# Altium schematic sheet power.SchDoc
size A2; SPICEModelCacheUWPXBFBI: <root> / <DocumentId>UWPXBFBI</DocumentId> / </root>
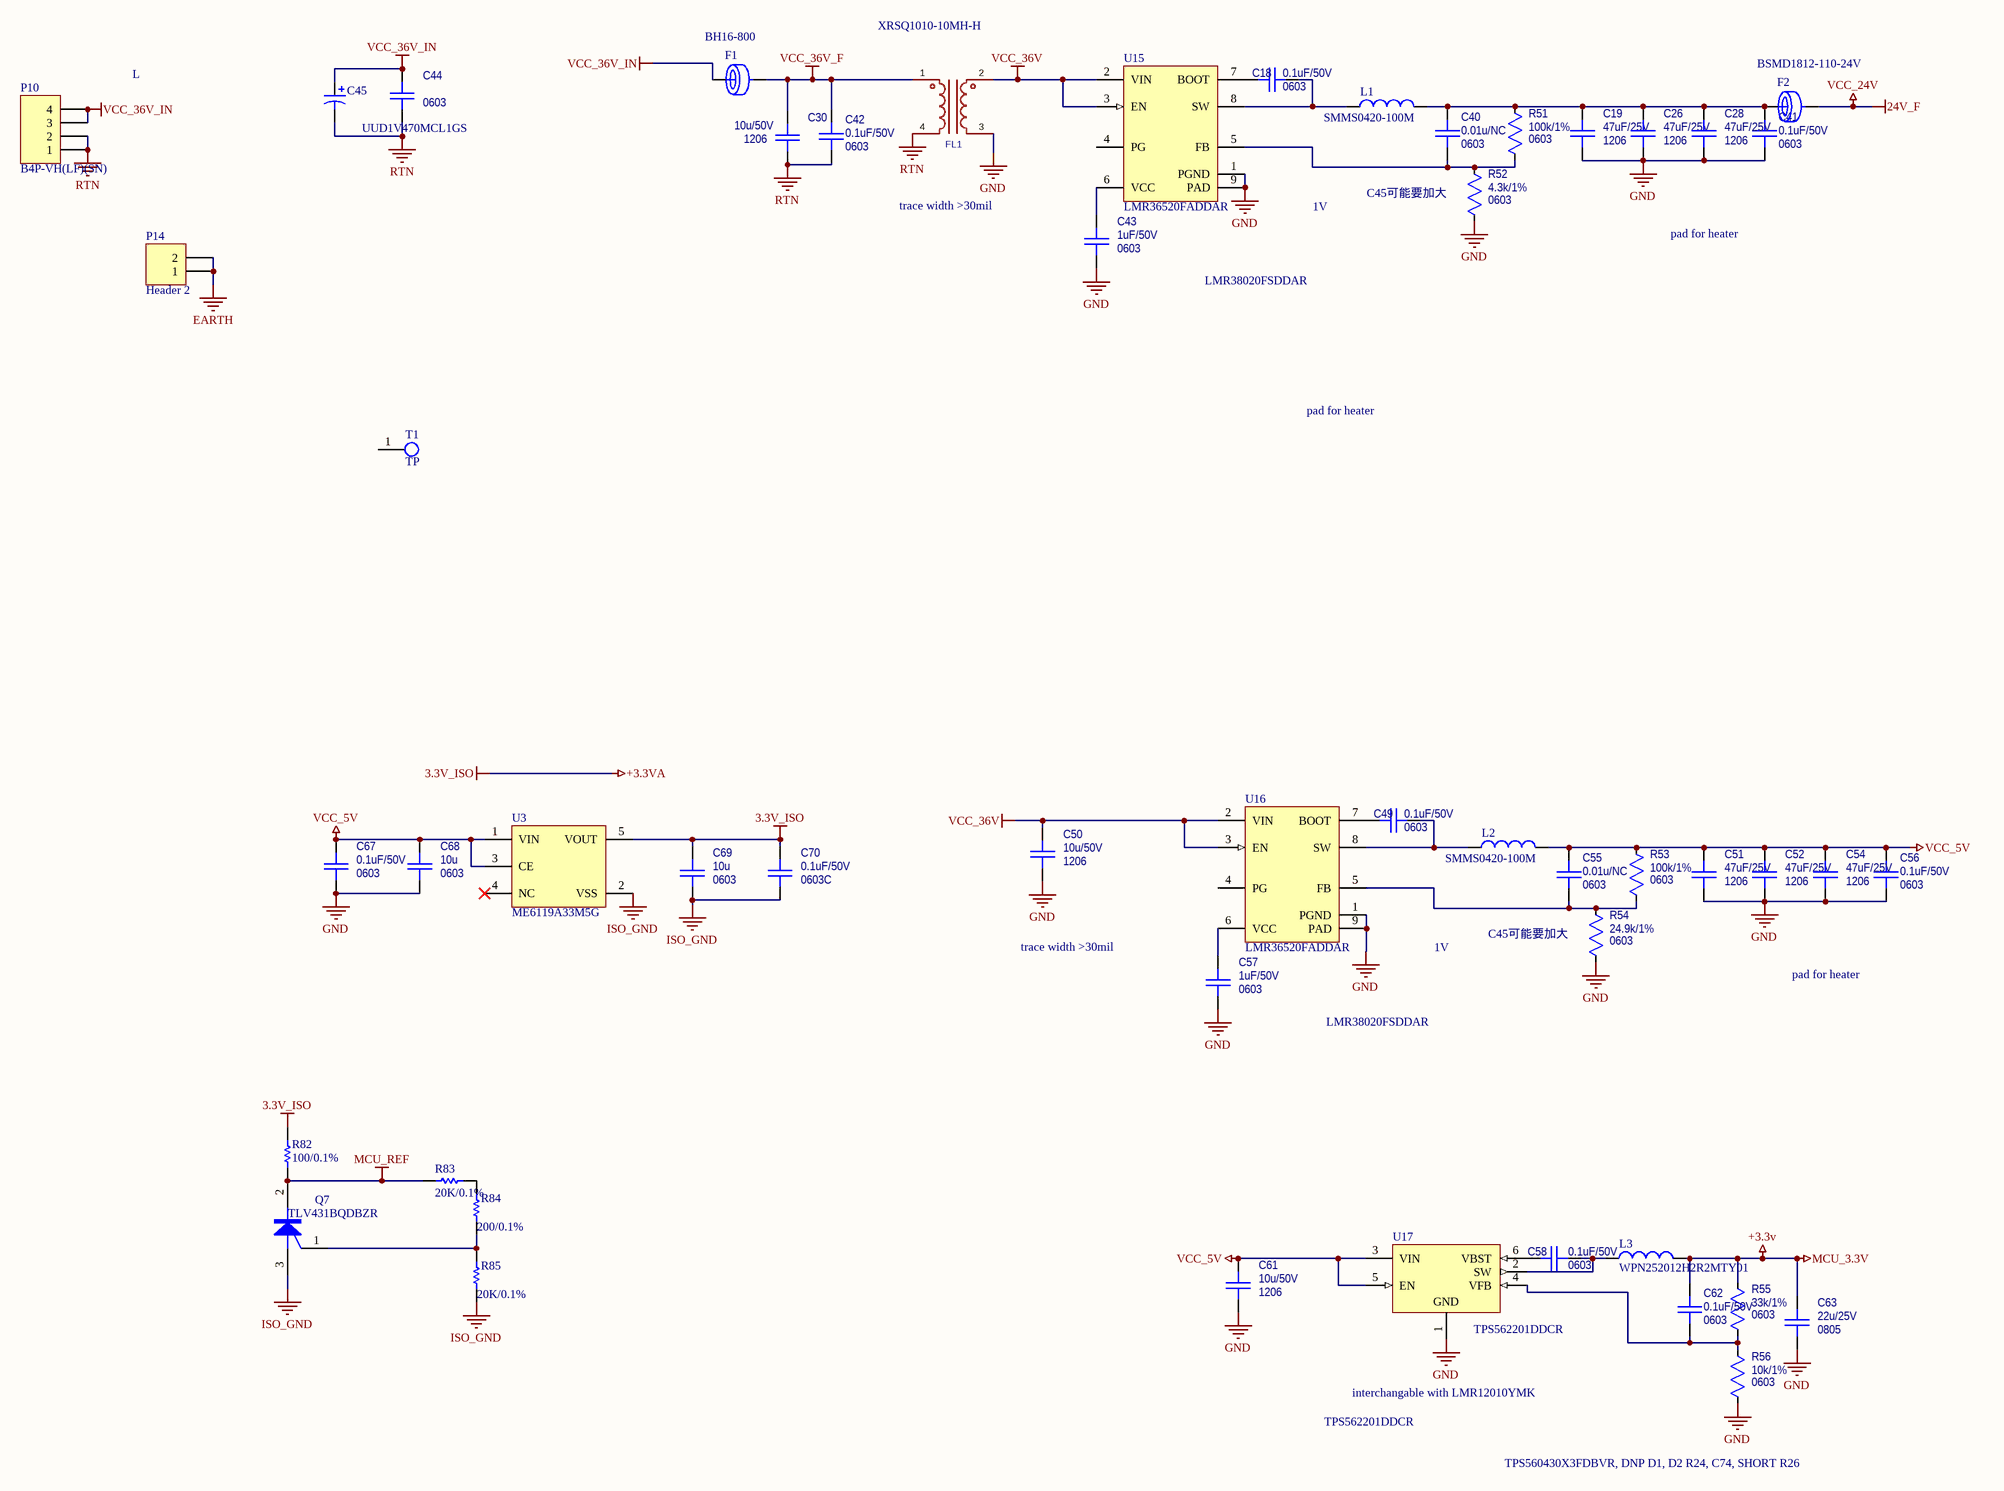
[diagram p0: power.SchDoc]

## Parts
C18  Package: 0603  [0603C]  (hidden comment: 0.1uF/50V)
C19  Package: 1206  [CAPC3216X156N_1206]  (hidden comment: 47uF/25V)
C26  Package: 1206  [CAPC3216X156N_1206]  (hidden comment: 47uF/25V)
C28  Package: 1206  [CAPC3216X156N_1206]  (hidden comment: 47uF/25V)
C30  Package: 1206  [CAPC3216X156N_1206]  (hidden comment: 10u/50V)
C40  value 0.01u/NC  Package: 0603  [0603C]  (hidden comment: 0.01uF/50V)  (no BOM)
C41  Package: 0603  [0603C]  (hidden comment: 0.1uF/50V)
C42  Package: 0603  [0603C]  (hidden comment: 0.1uF/50V)
C43  Package: 0603  [0603C]  (hidden comment: 1uF/50V)
C44  Package: 0603  [0603c]  (hidden comment: 10uF/16V)
C45  UUD1V470MCL1GS  [Φ10×10]
C49  Package: 0603  [0603C]  (hidden comment: 0.1uF/50V)
C50  Package: 1206  [CAPC3216X156N_1206]  (hidden comment: 10u/50V)
C51  Package: 1206  [CAPC3216X156N_1206]  (hidden comment: 47uF/25V)
C52  Package: 1206  [CAPC3216X156N_1206]  (hidden comment: 47uF/25V)
C54  Package: 1206  [CAPC3216X156N_1206]  (hidden comment: 47uF/25V)
C55  value 0.01u/NC  Package: 0603  [0603C]  (hidden comment: 0.01uF/50V)  (no BOM)
C56  Package: 0603  [0603C]  (hidden comment: 0.1uF/50V)
C57  Package: 0603  [0603C]  (hidden comment: 1uF/50V)
C58  Package: 0603  [0603C]  (hidden comment: 0.1uF/50V)
C61  Package: 1206  [CAPC3216X156N_1206]  (hidden comment: 10u/50V)
C62  Package: 0603  [0603C]  (hidden comment: 0.1uF/50V)  (no BOM)
C63  Package: 0805  [CAPC2012X127N_0805]  (hidden comment: 22u/25V)
C67  Package: 0603  [0603C]  (hidden comment: 0.1uF/50V)
C68  value 10u  Package: 0603  [0603c]  (hidden comment: 10uF/16V)
C69  value 10u  Package: 0603  [0603c]  (hidden comment: 10uF/16V)
C70  0.1uF/50V  [0603C]
F1  BH16-800  [FUSE-TH_L14.0-W3.0-P5.10-D0.8-LS1.20]
F2  BSMD1812-110-24V  [1812-F]
FL1  XRSQ1010-10MH-H  [IND-TH_4P-L14.0-W12.0_XRSQ1010-10MH-H]
L1  SMMS0420-100M  [IND-SMD_L4.5-W4.5_SMMS0420]
L2  SMMS0420-100M  [IND-SMD_L4.5-W4.5_SMMS0420]
L3  WPN252012H2R2MTY01  [PULS-BDCD00252012_V]
P10  B4P-VH(LF)(SN)  [CONN-TH_4P-P3.96_HX-VH3.96-4P-ZZ]
P14  Header 2  [插片端子4.8*0.8mm]
Q7  TLV431BQDBZR  [SOT23-3]
R51  Package: 0603  [0603R]  (hidden comment: 100k/1%)
R52  Package: 0603  [0603R]  (hidden comment: 4.3k/1%)
R53  Package: 0603  [0603R]  (hidden comment: 100k/1%)
R54  Package: 0603  [0603R]  (hidden comment: 24.9k/1%)
R55  Package: 0603  [0603R]  (hidden comment: 33k/1%)
R56  Package: 0603  [0603R]  (hidden comment: 10k/1%)
R82  100/0.1%  [0603R]
R83  20K/0.1%  [0603R]
R84  200/0.1%  [0603R]
R85  20K/0.1%  [0603R]
T1  TP  [SQP-1181C]
U3  ME6119A33M5G  [MCRN-SOT23-5_V]
U15  LMR36520FADDAR  [DDA0008A_M]
U16  LMR36520FADDAR  [DDA0008A_M]
U17  TPS562201DDCR  [DDC0006A_L]

## Nets
24V_F: F2.2  [also labelled VCC_24V]
+3.3v: C62.1 C63.1 L3.2 R55.2  [also labelled MCU_3.3V]
+3.3VA: C69.1 C70.1 R82.1 U3.5(VOUT)  [also labelled 3.3V_ISO]
EARTH: P14.1 P14.2
GND: C19.2 C26.2 C28.2 C41.2 C43.2 C50.2 C51.2 C52.2 C54.2 C56.2 C57.2 C61.2 C63.2 C67.2 C68.2 FL1.3 R52.1 R54.1 R56.1 U15.1(PGND) U15.9(PAD) U16.1(PGND) U16.9(PAD) U17.1(GND)
ISO_GND: C69.2 C70.2 Q7.3(A) R85.2 U3.2(VSS)
MCU_REF: Q7.2(K) R82.2 R83.1
RTN: C30.2 C42.2 C44.2 C45.2 FL1.4 P10.1 P10.2
VCC_5V: C51.1 C52.1 C54.1 C55.1 C56.1 C61.1 C67.1 C68.1 L2.2 R53.2 U3.1(VIN) U3.3(CE) U17.3(VIN) U17.5(EN)
VCC_36V: C50.1 FL1.2 U15.2(VIN) U15.3(EN) U16.2(VIN) U16.3(EN)
VCC_36V_F: C30.1 C42.1 F1.2 FL1.1
VCC_36V_IN: C44.1 C45.1 F1.1 P10.3 P10.4
NetC18_1: C18.1 U15.7(BOOT)
NetC18_2: C18.2 L1.1 U15.8(SW)
NetC19_1: C19.1 C26.1 C28.1 C40.1 C41.1 F2.1 L1.2 R51.2
NetC40_2: C40.2 R51.1 R52.2 U15.5(FB)
NetC43_1: C43.1 U15.6(VCC)
NetC49_1: C49.1 U16.7(BOOT)
NetC49_2: C49.2 L2.1 U16.8(SW)
NetC55_2: C55.2 R53.1 R54.2 U16.5(FB)
NetC57_1: C57.1 U16.6(VCC)
NetC58_1: C58.1 U17.6(VBST)
NetC58_2: C58.2 L3.1 U17.2(SW)
NetC62_2: C62.2 R55.1 R56.2 U17.4(VFB)
NetQ7_1: Q7.1(G) R84.2 R85.1
NetR83_2: R83.2 R84.1

Not connected (* = marked no-connect by the designer): T1 1; U3 4(NC)*; U15 4(PG); U16 4(PG)

## Notes on the sheet
- L
- C45可能要加大
- trace width >30mil
- 1V
- pad for heater
- LMR38020FSDDAR
- interchangable with LMR12010YMK
- TPS562201DDCR
- TPS560430X3FDBVR, DNP D1, D2 R24, C74, SHORT R26

## Library data of the parts
C18 C40-C43 C49 C55-C58 C62 = Capacitor_0603: Voltage Rating: [voltage]
  C18 C41 C42 C49 C56 C58 C62: Value: 0.1uF/50V
  C43 C57: Value: 1uF/50V
C19 C26 C28 C30 C50-C52 C54 = Capacitor_1206: Voltage Rating: [voltage]
  C19 C26 C28 C51 C52 C54: Value: 47uF/25V
  C30 C50: Value: 10u/50V
C44 C67-C69 = Capacitor_0603: Capacitor, MLCC; Voltage Rating: [voltage]
  C67: Value: 0.1uF/50V
C45 = Cap Pol1: Polarized Capacitor (Radial); Value: 220uF/50V; Package: Φ10×10
C61 C63 = Capacitor_0805: Voltage Rating: [voltage]
  C61: Value: 10u/50V
  C63: Value: 22u/25V
C70 = Capacitor_0402: Capacitor, MLCC; Voltage Rating: [voltage]; Package: 0603C; Value: 0.1uF/50V
F1 = FBC0603: Ferrite Bead Chip; Value: BSMD1812-110-24V; Package: FUSE-TH_L14.0-W3.0-P5.10-D0.8-LS1.20
F2 = FBC0603: Ferrite Bead Chip; Value: BSMD1812-110-24V; Package: 1812-F
L1 L2 = 1276AS-H-100M=P2: Metal alloy Power Inductor, 10 uH, ±20%, 1210 (3225); Value: SMMS0420-100M; Package: IND-SMD_L4.5-W4.5_SMMS0420
L3 = BDCD002520122R2MS1: Value: BDCD002520122R2MS1; Package: PULS-BDCD00252012_V
P10 = Header 4: Header, 4-Pin; Package: CONN-TH_4P-P3.96_HX-VH3.96-4P-ZZ
P14 = Header 2: Header, 2-Pin; Package: 插片端子4.8*0.8mm
Q7 = PUT: Programmable Unijunction Transistor; Package: SOT23-3
R51-R56 = Resistor_0603
  R51 R53: Value: 100k/1%
  R52: Value: 4.3k/1%
  R54: Value: 24.9k/1%
  R55: Value: 33k/1%
  R56: Value: 10k/1%
R82-R85 = Res1: Resistor; Package: 0603
  R83 R85: Value: 20K/0.1%
  R84: Value: 200/0.1%
U3 = ME6119C50M5G: High Speed LDO Regulators, Low ESR, 5.0 V, 400 mA, -40 to 125 degC, 5-Pin SOT-23, RoHS, Tape and Reel; Package: MCRN-SOT23-5_V
FL1 = XRSQ1010-10MH-H: Package: IND-TH_4P-L14.0-W12.0_XRSQ1010-10MH-H
T1 = TP: Package: SQP-1181C
U15 U16 = LMR36520FADDAR: Value: LMR36520FADDAR; Package: DDA0008A_M
U17 = TPS562201DDCR: Width: 1.01 mm; Value: TPS562201DDCR; Package: DDC0006A_L